# Altium schematic sheet OpAmpNegativeSupply.SchDoc
size Letter; CompanyName: Ploopy Corporation; Organization: Ploopy Corporation; Address1: Suite 226, 137-1140 Burnhamthorpe Road W; Address2: Mississauga; Address3: Ontario; Address4: Canada L5C 0A3; DocumentNumber: 6; Revision: R1.007; SheetNumber: 6; SheetTotal: 11
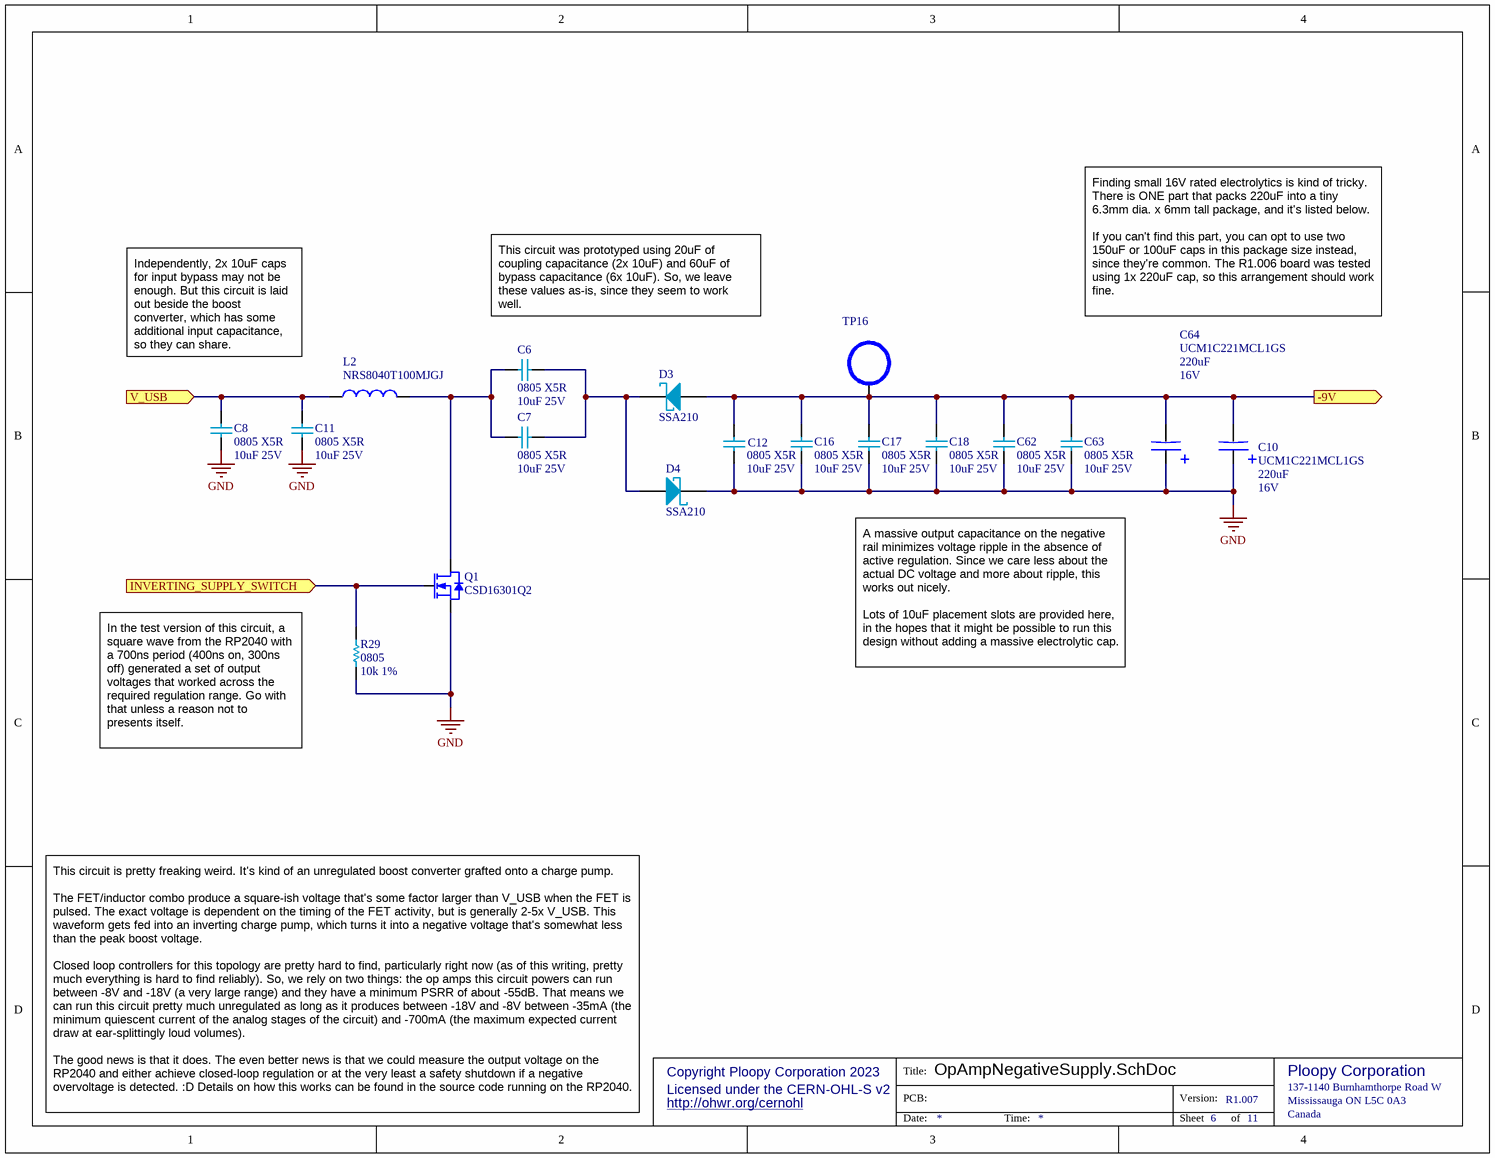
[diagram p0: OpAmpNegativeSupply.SchDoc]

## Parts
C6  0805 X5R  value 10uF 25V  [0805 - TALL]
C7  0805 X5R  value 10uF 25V  [0805 - TALL]
C8  0805 X5R  value 10uF 25V  [0805 - TALL]
C10  UCM1C221MCL1GS  value 220uF  Voltage: 16V  [SMT cap -  6.6mm x 6.6mm land]
C11  0805 X5R  value 10uF 25V  [0805 - TALL]
C12  0805 X5R  value 10uF 25V  [0805 - TALL]
C16  0805 X5R  value 10uF 25V  [0805 - TALL]
C17  0805 X5R  value 10uF 25V  [0805 - TALL]
C18  0805 X5R  value 10uF 25V  [0805 - TALL]
C62  0805 X5R  value 10uF 25V  [0805 - TALL]
C63  0805 X5R  value 10uF 25V  [0805 - TALL]
C64  UCM1C221MCL1GS  value 220uF  Voltage: 16V  [SMT cap -  6.6mm x 6.6mm land]
D3  SSA210  [SSA210 - DO-214AC]
D4  SSA210  [SSA210 - DO-214AC]
L2  NRS8040T100MJGJ  [NRS8040T100MJGJ]
Q1  CSD16301Q2  [CSD16301Q2 - SON65P200X80_HS-7M]
R29  0805  value 10k 1%  [0805]
TP16  TestPointHook  [S2751-46R]  (value not drawn)

## Ports
-9V (out), INVERTING_SUPPLY_SWITCH (in), V_USB (in)

## Nets
GND: C8.1 C10.1 C11.1 C12.2 C16.2 C17.2 C18.2 C62.2 C63.2 C64.1 D4.1(C) Q1.S R29.1
-9V: C10.2 C12.1 C16.1 C17.1 C18.1 C62.1 C63.1 C64.2 D3.2 TP16.1 ; port -9V
INVERTING_SUPPLY_SWITCH: Q1.G R29.2 ; port INVERTING_SUPPLY_SWITCH
V_USB: C8.2 C11.2 L2.1 ; port V_USB
NetC6_1: C6.1 C7.1 D3.1(C) D4.2
NetC6_2: C6.2 C7.2 L2.2 Q1.D

## Notes on the sheet
- Independently, 2x 10uF caps for input bypass may not be enough. But this circuit is laid out beside the boost converter, which has some additional input capacitance, so they can share.
- This circuit was prototyped using 20uF of coupling capacitance (2x 10uF) and 60uF of bypass capacitance (6x 10uF). So, we leave these values as-is, since they seem to work well.
- Finding small 16V rated electrolytics is kind of tricky. There is ONE part that packs 220uF into a tiny 6.3mm dia. x 6mm tall package, and it's listed below.
  If you can't find this part, you can opt to use two 150uF or 100uF caps in this package size instead, since they're common. The R1.006 board was tested using 1x 220uF cap, so this arrangement should work fine.
  EEV107M016S9GAA is a good choice.
- A massive output capacitance on the negative rail minimizes voltage ripple in the absence of active regulation. Since we care less about the actual DC voltage and more about ripple, this works out nicely.
  Lots of 10uF placement slots are provided here, in the hopes that it might be possible to run this design without adding a massive electrolytic cap.
- In the test version of this circuit, a square wave from the RP2040 with a 700ns period (400ns on, 300ns off) generated a set of output voltages that worked across the required regulation range. Go with that unless a reason not to presents itself.
- This circuit is pretty freaking weird. It's kind of an unregulated boost converter grafted onto a charge pump.
  The FET/inductor combo produce a square-ish voltage that's some factor larger than V_USB when the FET is pulsed. The exact voltage is dependent on the timing of the FET activity, but is generally 2-5x V_USB. This waveform gets fed into an inverting charge pump, which turns it into a negative voltage that's somewhat less than the peak boost voltage.
  Closed loop controllers for this topology are pretty hard to find, particularly right now (as of this writing, pretty much everything is hard to find reliably). So, we rely on two things: the op amps this circuit powers can run between -8V and -18V (a very large range) and they have a minimum PSRR of about -55dB. That means we can run this circuit pretty much unregulated as long as it produces between -18V and -8V between -35mA (the minimum quiescent current of the analog stages of the circuit) and -700mA (the maximum expected current draw at ear-splittingly loud volumes).
  The good news is that it does. The even better news is that we could measure the output voltage on the RP2040 and either achieve closed-loop regulation or at the very least a safety shutdown if a negative overvoltage is detected. :D Details on how this works can be found in the source code running on the RP2040.
- Copyright Ploopy Corporation 2023
- Licensed under the CERN-OHL-S v2
- http://ohwr.org/cernohl
- Title:
- PCB:
- Version:
- Ploopy Corporation
- Mississauga ON L5C 0A3
- 137-1140 Burnhamthorpe Road W
- Date:
- Time:
- Sheet
- of
- Canada

## Library data of the parts
C6-C8 C11 C12 C16-C18 C62 C63 = Cap 10uF 25V: 0805, X5R or better; Supplier 1: Mouser; Supplier Part Number 1: 81-GRM21BR61E106KA3L; Supplier 2: Digi-Key; Supplier Part Number 2: 490-5523-1-ND
C10 C64 = UCM1C221MCL1GS: 220uF 16V Electrolytic Capacitor, SMD 6.3mm dia x 6.1mm height; PNP-Nzl: 6; PNP-dx: 0; PNP-X: 8.3; PNP-Y: 1; PNP-Pt: 2; PNP-Thk: 5.4; PNP-Lv: 26; PNP-TS: 70; PNP-Type: CAP; PNP-FeedType: Tape; PNP-TapeWidth: 16; PNP-TapeIndex: 3; PNP-dy: 0; PNP-A: 0; PNP-W: 0; PNP-Level: 1; PNP-Voff: 0; PNP-PlacePriority: 2; PNP-da: 0; Supplier 1: Digi-Key; Supplier Part Number 1: 493-14527-1-ND
D3 D4 = SSA210: 100V 2A Shottky Diode (Rectifier); Supplier 1: Mouser; Supplier Part Number 1: 512-SSA210; Supplier 2: Digi-Key; Supplier Part Number 2: SSA210CT-ND
L2 = NRS8040T100MJGJ: FIXED IND 10UH 3.1A 44.2MOHM SMD
Q1 = CSD16301Q2: 25-V N-Channel Power MOSFET, 20mOhm, 2nC Qg
R29 = Res 10k 1% 0805: Chip resistor; Supplier 1: Digi-Key; Supplier Part Number 1: RMCF0805FT10K0TR-ND
TP16 = TestPointHook: Test point, SMT ring (micro-hook compatible); Supplier 1: Digi-Key; Supplier Part Number 1: 952-2664-6-ND; Supplier 2: Digi-Key; Supplier Part Number 2: A106144DKR-ND; Supplier 3: Arrow; Supplier Part Number 3: z_4zPAhGJpPHHYBcC24zmONEz5elv0VZALWfNkICq0w